# Altium schematic sheet Sheet1.SchDoc
size A4
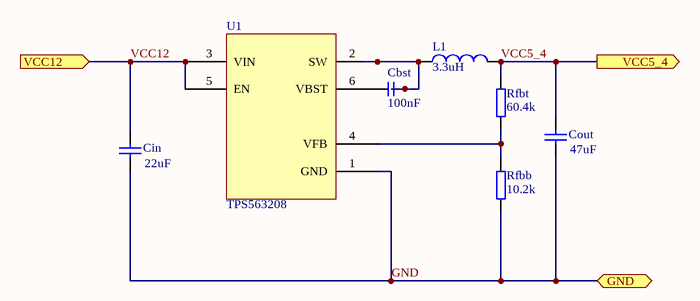
[diagram p0: Sheet1.SchDoc]

## Parts
Cbst  100nF  [CAP0402R]
Cin  value 22uF  [RAD-0.3]  (hidden comment: Cap)
Cout  value 47uF  [RAD-0.3]  (hidden comment: Cap)
L1  value 3.3uH  [INDC4532]  (hidden comment: Inductor)
Rfbb  10.2k  [RES0402R]
Rfbt  60.4k  [RES0402R]
U1  TPS563208

## Ports
GND (bidir), VCC5_4 (out), VCC12 (in)

## Nets
GND: Cin.1 Cout.1 Rfbb.1 U1.1(GND) ; port GND
VCC5_4: Cout.2 L1.2 Rfbt.2 ; port VCC5_4
VCC12: Cin.2 U1.3(VIN) U1.5(EN) ; port VCC12
NetCbst_1: Cbst.1 L1.1 U1.2(SW)
NetCbst_2: Cbst.2 U1.6(VBST)
NetRfbb_2: Rfbb.2 Rfbt.1 U1.4(VFB)

## Library data of the parts
Cbst = CAP: Capacitor; Note: *; Desc: *; Value: 100nF
Cin Cout = Cap: Capacitor; Published: 8-Jun-2000; LatestRevisionDate: 17-Jul-2002; LatestRevisionNote: Re-released for DXP Platform.; PackageReference: RAD-0.3; Publisher: Altium Limited; PackageDescription: Radial Cap, Thru-Hole; 2 Leads; 0.3 in Pin Spacing
L1 = Inductor: Code_IEC: 1005; Published: 8-Jun-2000; LatestRevisionDate: 29-May-2009; LatestRevisionNote: IPC-7351 Footprint Added.; PackageReference: 0402-A; Publisher: Altium Limited; PackageDescription: Chip Inductor; Code_JEITA: 0402
Rfbb Rfbt = RES: Resistor; Note: *; Desc: *
  Rfbb: Value: 10.2k
  Rfbt: Value: 60.4k